# Altium schematic sheet Schematic.SchDoc
size A1
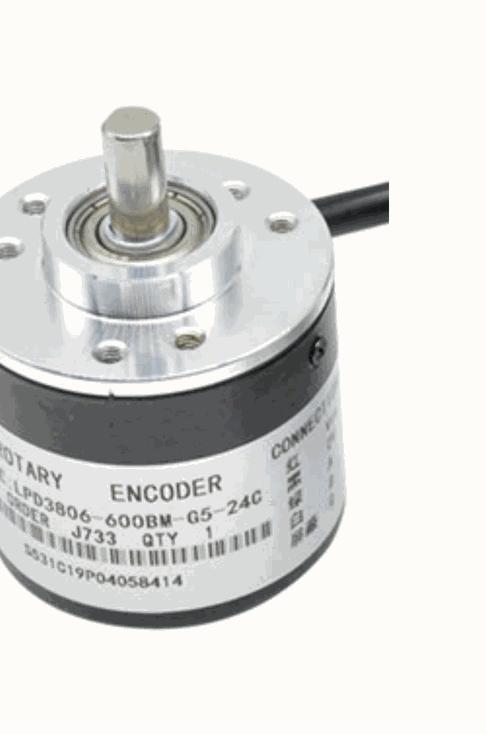
[diagram p0: Schematic.SchDoc, top right]
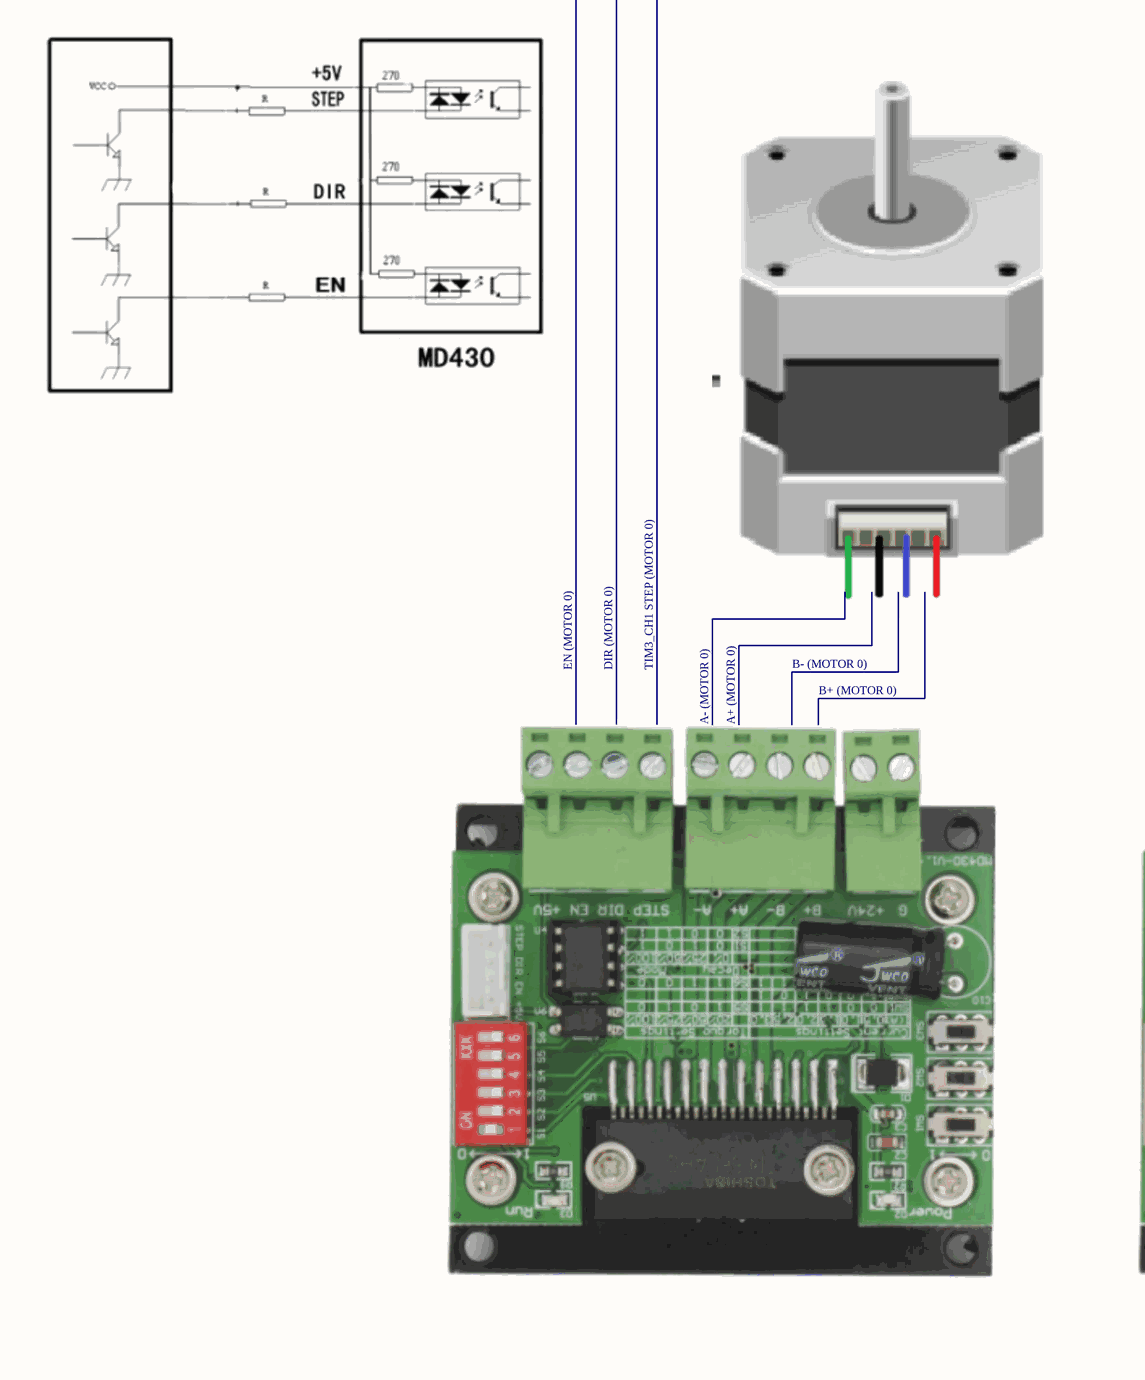
[diagram p1: Schematic.SchDoc, bottom left]
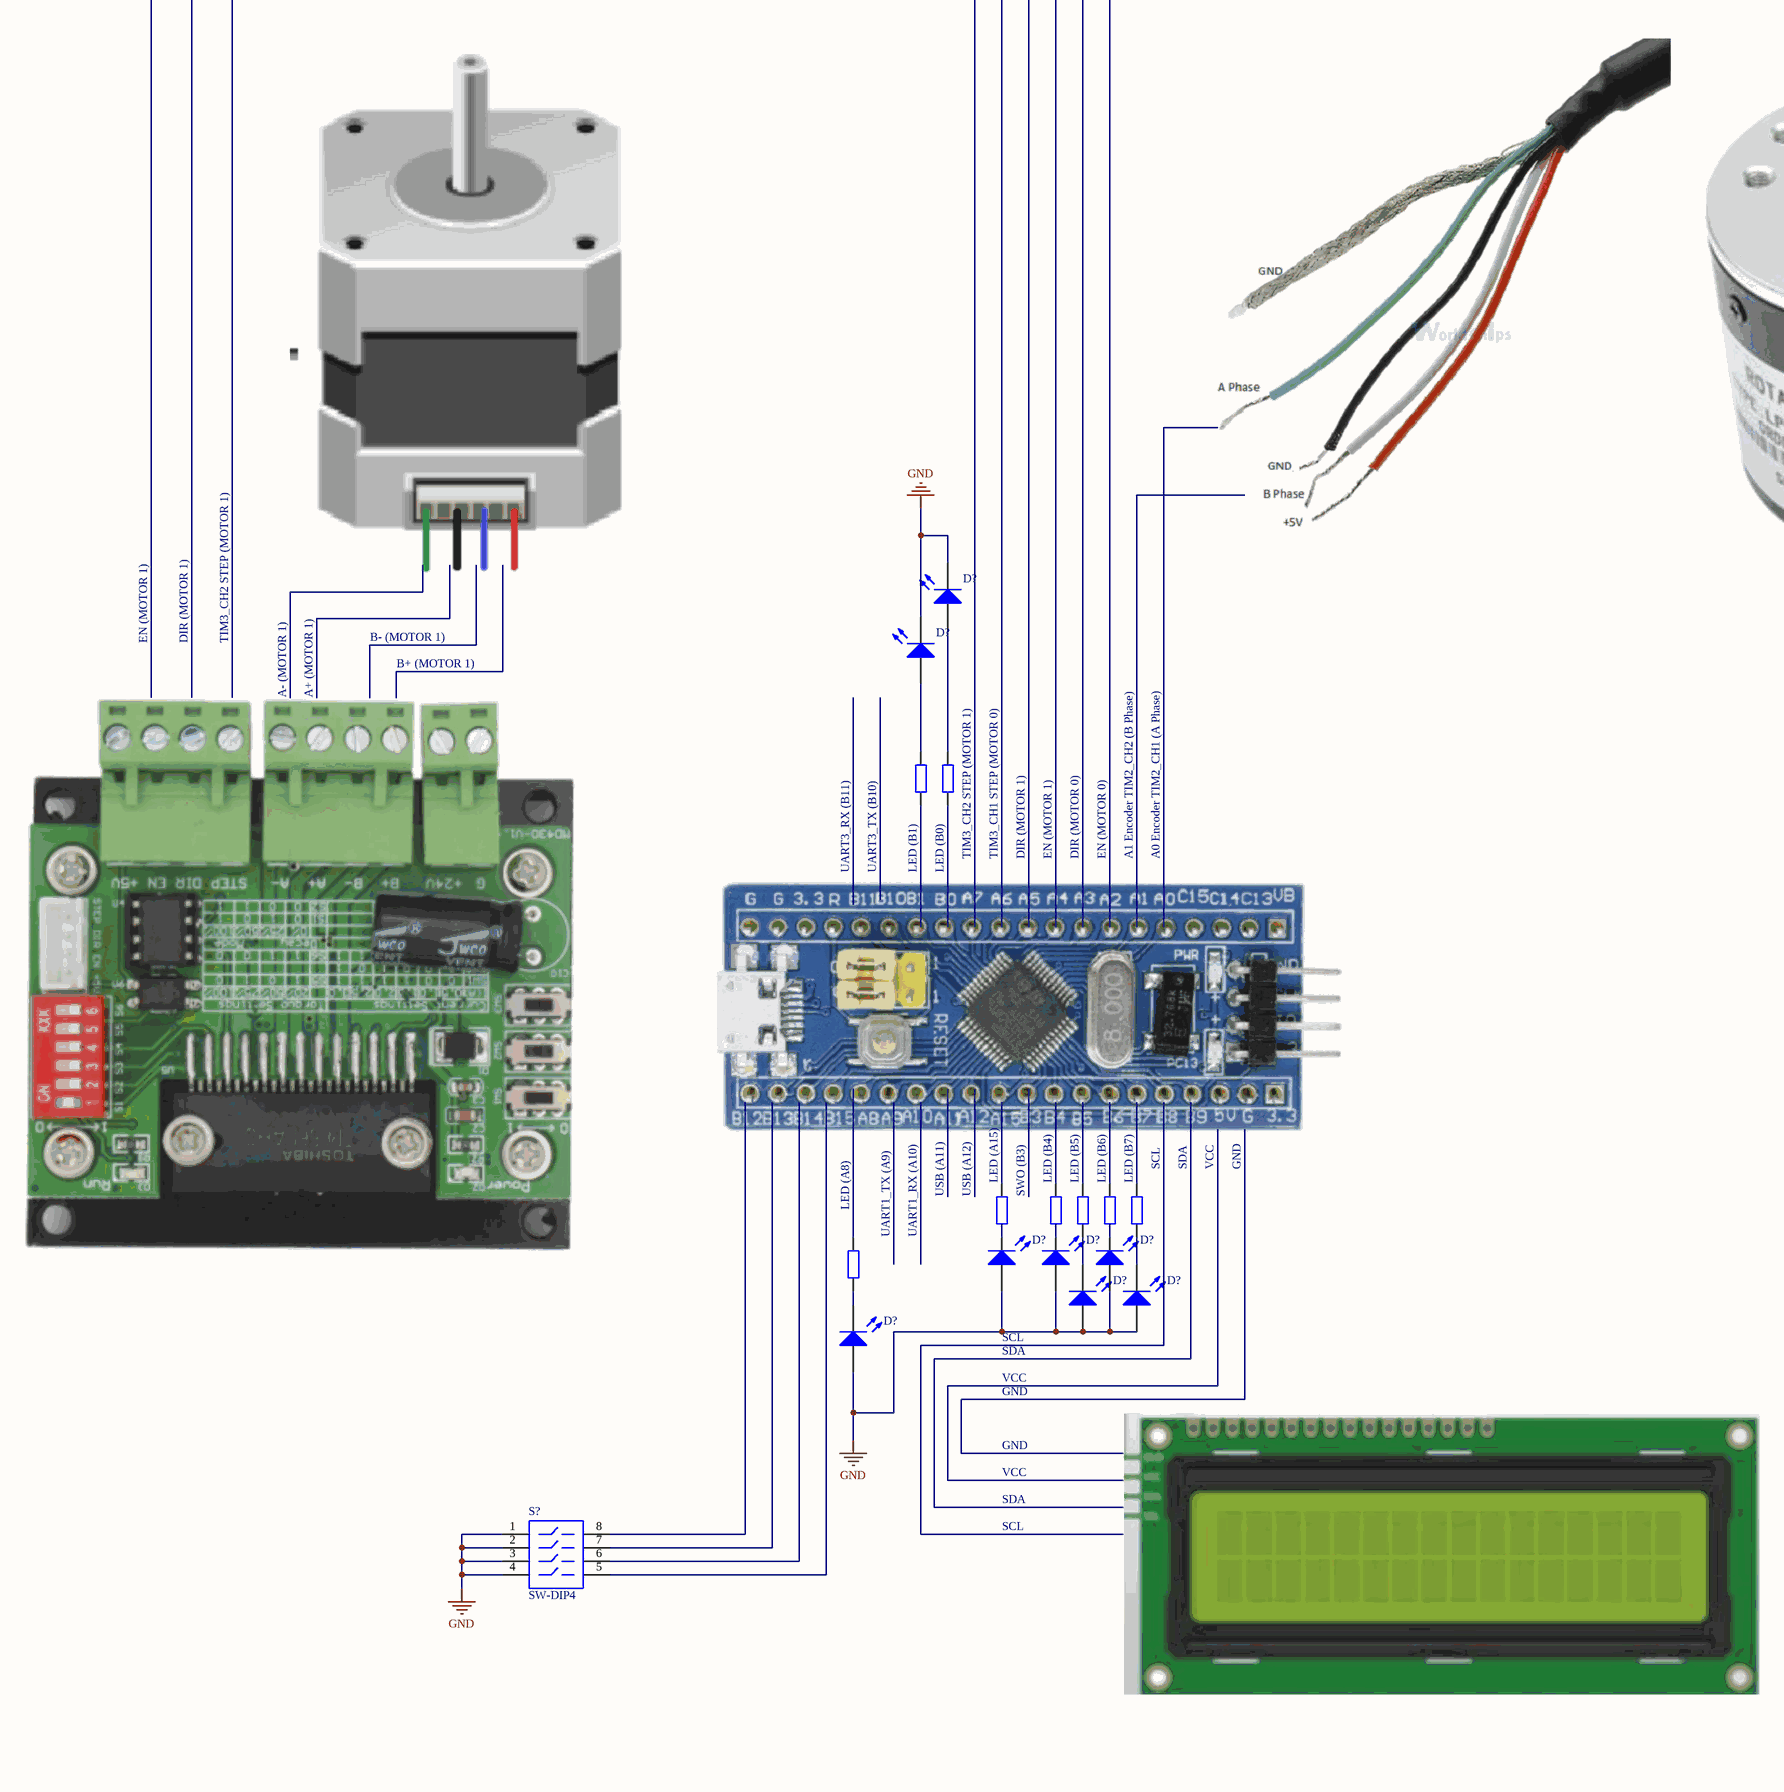
[diagram p2: Schematic.SchDoc, bottom middle]
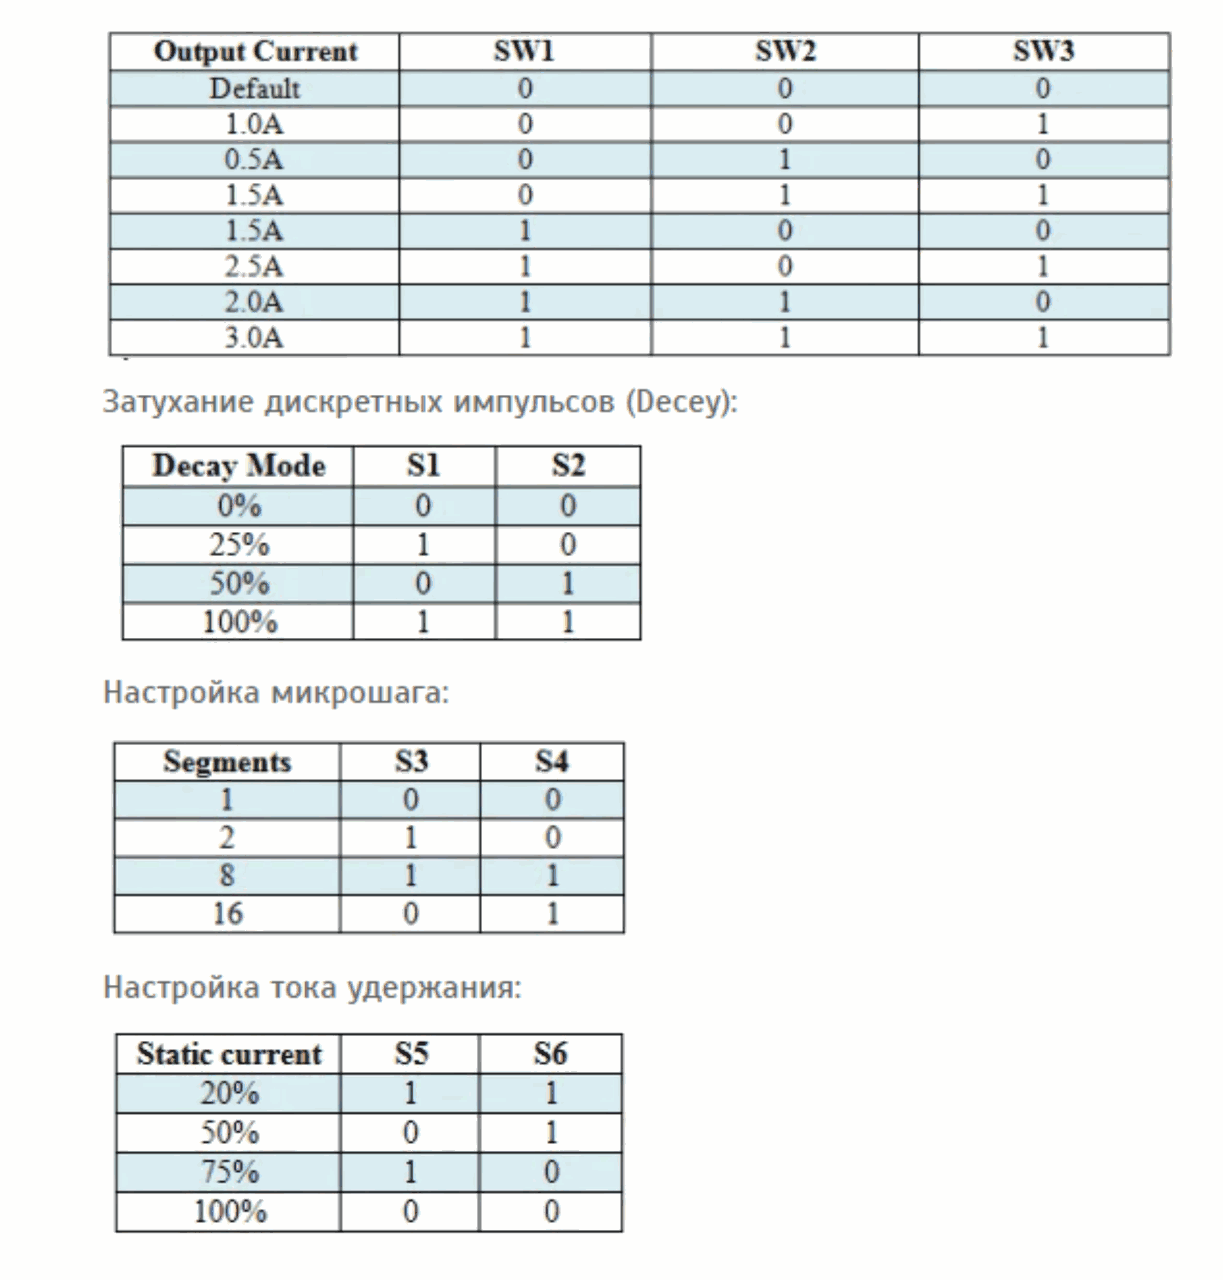
[diagram p3: Schematic.SchDoc, bottom right]

## Parts
(Parts that share a designator on the sheet are numbered #1, #2 ... from top to bottom, then left to right.)
D?#1  LED3  [3.5X2.8X1.9]  (value not drawn)
D?#2  LED3  [3.5X2.8X1.9]  (value not drawn)
D?#3  LED3  [3.5X2.8X1.9]  (value not drawn)
D?#4  LED3  [3.5X2.8X1.9]  (value not drawn)
D?#5  LED3  [3.5X2.8X1.9]  (value not drawn)
D?#6  LED3  [3.5X2.8X1.9]  (value not drawn)
D?#7  LED3  [3.5X2.8X1.9]  (value not drawn)
D?#8  LED3  [3.5X2.8X1.9]  (value not drawn)
R?#1  Res2  [AXIAL-0.4]  (value not drawn)
R?#2  Res2  [AXIAL-0.4]  (value not drawn)
R?#3  Res2  [AXIAL-0.4]  (value not drawn)
R?#4  Res2  [AXIAL-0.4]  (value not drawn)
R?#5  Res2  [AXIAL-0.4]  (value not drawn)
R?#6  Res2  [AXIAL-0.4]  (value not drawn)
R?#7  Res2  [AXIAL-0.4]  (value not drawn)
R?#8  Res2  [AXIAL-0.4]  (value not drawn)
S?  SW-DIP4  [DIP-8]

## Nets
GND: D?#1.2(K) D?#2.2(K) D?#3.1(A) D?#4.1(A) D?#5.1(A) D?#6.1(A) D?#7.1(A) D?#8.1(A) S?.1 S?.2 S?.3 S?.4
NetD?#1_1: D?#1.1(A) R?#2.2
NetD?#2_1: D?#2.1(A) R?#1.2
NetD?#3_2: D?#3.2(K) R?#3.1
NetD?#4_2: D?#4.2(K) R?#4.1
NetD?#5_2: D?#5.2(K) R?#6.1
NetD?#6_2: D?#6.2(K) R?#5.1
NetD?#7_2: D?#7.2(K) R?#7.1
NetD?#8_2: D?#8.2(K) R?#8.1

Not connected (* = marked no-connect by the designer): R?#1 1; R?#2 1; R?#3 2; R?#4 2; R?#5 2; R?#6 2; R?#7 2; R?#8 2; S? 5 6 7 8

## Notes on the sheet
- EN (MOTOR 0)
- DIR (MOTOR 0)
- TIM3_CH1 STEP (MOTOR 0)
- A- (MOTOR 0)
- A+ (MOTOR 0)
- B- (MOTOR 0)
- B+ (MOTOR 0)
- EN (MOTOR 1)
- DIR (MOTOR 1)
- TIM3_CH2 STEP (MOTOR 1)
- A- (MOTOR 1)
- A+ (MOTOR 1)
- B- (MOTOR 1)
- B+ (MOTOR 1)
- UART3_RX (B11)
- (near R?#1) UART3_TX (B10)
- (near R?#1) LED (B1)
- (near R?#2) LED (B0)
- (near R?#2) TIM3_CH2 STEP (MOTOR 1)
- (near R?#2) TIM3_CH1 STEP (MOTOR 0)
- A1 Encoder TIM2_CH2 (B Phase)
- A0 Encoder TIM2_CH1 (A Phase)
- (near R?#7) SCL
- (near R?#7) SDA
- VCC
- GND
- (near R?#8) LED (A8)
- (near R?#8) UART1_TX (A9)
- UART1_RX (A10)
- USB (A11)
- (near R?#3) USB (A12)
- (near R?#3) LED (A15)
- (near R?#3) SWO (B3)
- (near R?#4) LED (B4)
- (near R?#5) LED (B5)
- (near R?#6) LED (B6)
- (near R?#7) LED (B7)
- SCL
- SDA

## Library data of the parts
D?#1-D?#8 = LED3: Typical BLUE SiC LED; Published: 8-Jun-2000; LatestRevisionDate: 17-Dec-2003; LatestRevisionNote: PCB Footprint replaced.; DatasheetVersion: 16-Apr-2002; PackageVersion: 16-Apr-2002; PackageReference: 3.5X2.8X1.9; Publisher: Altium Limited; PackageDescription: SM LED; 2 C-Bend Leads; Body 3.5 x 2.8 x 1.9 mm, inc leads (LxWxH typ)
R?#1-R?#8 = Res2: Resistor; Value: 1K; Published: 8-Jun-2000; LatestRevisionDate: 17-Jul-2002; LatestRevisionNote: Re-released for DXP Platform.; PackageReference: AXIAL-0.4; Publisher: Altium Limited; PackageDescription: Axial Device, Thru-Hole; 2 Leads; 0.4 in Pin Spacing
S? = SW-DIP4: DIP Switch; Published: 24-Mar-1999; LatestRevisionDate: 17-Jul-2002; LatestRevisionNote: Re-released for DXP Platform.; PackageReference: DIP-8; Publisher: Altium Limited